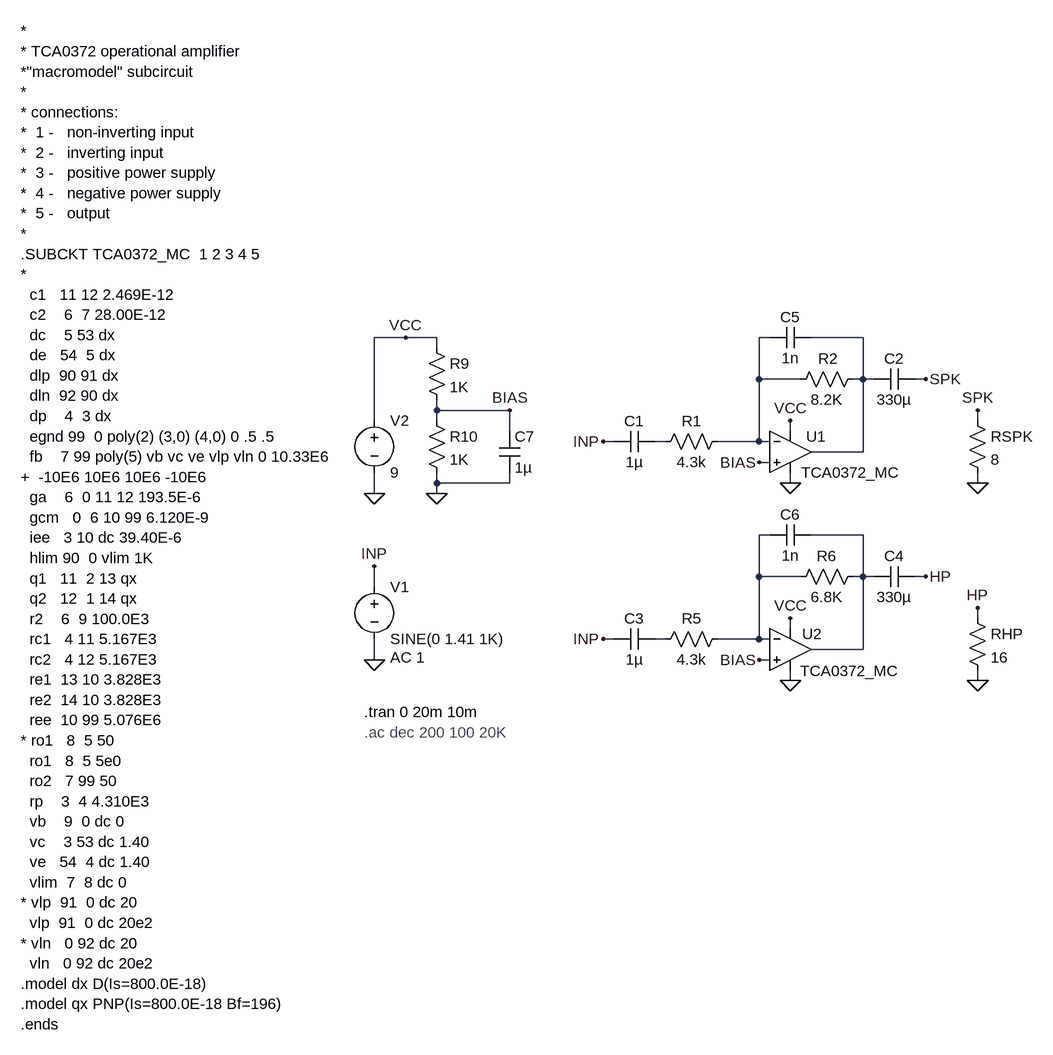
[diagram p0: schematic audio-amp.asc]
audio-amp.asc, the LTspice schematic file:
Version 4
SHEET 1 1860 1428
WIRE -784 -144 -832 -144
WIRE -736 -144 -784 -144
WIRE -224 -144 -240 -144
WIRE -80 -144 -160 -144
WIRE -736 -128 -736 -144
WIRE -240 -80 -240 -144
WIRE -176 -80 -240 -80
WIRE -80 -80 -80 -144
WIRE -80 -80 -96 -80
WIRE -64 -80 -80 -80
WIRE 16 -80 0 -80
WIRE -736 -32 -736 -48
WIRE -624 -32 -736 -32
WIRE -832 -16 -832 -144
WIRE -736 -16 -736 -32
WIRE 96 -16 96 -32
WIRE -624 0 -624 -32
WIRE -192 0 -192 -16
WIRE -464 16 -480 16
WIRE -384 16 -400 16
WIRE -240 16 -240 -80
WIRE -240 16 -304 16
WIRE -224 16 -240 16
WIRE -80 32 -80 -80
WIRE -80 32 -160 32
WIRE -224 48 -240 48
WIRE -736 80 -736 64
WIRE -624 80 -624 64
WIRE -624 80 -736 80
WIRE -192 80 -192 64
WIRE 96 80 96 64
WIRE -832 96 -832 64
WIRE -736 96 -736 80
WIRE -224 160 -240 160
WIRE -80 160 -160 160
WIRE -240 224 -240 160
WIRE -176 224 -240 224
WIRE -80 224 -80 160
WIRE -80 224 -96 224
WIRE -64 224 -80 224
WIRE 16 224 0 224
WIRE -832 240 -832 208
WIRE 96 288 96 272
WIRE -192 304 -192 288
WIRE -464 320 -480 320
WIRE -384 320 -400 320
WIRE -240 320 -240 224
WIRE -240 320 -304 320
WIRE -224 320 -240 320
WIRE -80 336 -80 224
WIRE -80 336 -160 336
WIRE -832 352 -832 320
WIRE -224 352 -240 352
WIRE -192 384 -192 368
WIRE 96 384 96 368
FLAG -832 352 0
FLAG -832 208 INP
FLAG -832 96 0
FLAG -784 -144 VCC
FLAG -480 16 INP
FLAG -192 -16 VCC
FLAG 96 80 0
FLAG -192 80 0
FLAG -480 320 INP
FLAG -192 288 VCC
FLAG 96 384 0
FLAG -192 384 0
FLAG 96 272 HP
FLAG -624 -32 BIAS
FLAG -736 96 0
FLAG -240 48 BIAS
FLAG -240 352 BIAS
FLAG 16 -80 SPK
FLAG 96 -32 SPK
FLAG 16 224 HP
SYMBOL voltage -832 224 R0
WINDOW 123 24 124 Left 2
WINDOW 39 0 0 Left 0
SYMATTR Value2 AC 1
SYMATTR InstName V1
SYMATTR Value SINE(0 1.41 1K)
SYMBOL voltage -832 -32 R0
WINDOW 123 0 0 Left 0
WINDOW 39 0 0 Left 0
SYMATTR InstName V2
SYMATTR Value 9
SYMBOL res -288 0 R90
WINDOW 0 0 56 VBottom 2
WINDOW 3 32 56 VTop 2
SYMATTR InstName R1
SYMATTR Value 4.3k
SYMBOL res -80 -96 R90
WINDOW 0 0 54 VBottom 2
WINDOW 3 32 56 VTop 2
SYMATTR InstName R2
SYMATTR Value 8.2K
SYMBOL cap -400 0 R90
WINDOW 0 0 32 VBottom 2
WINDOW 3 32 32 VTop 2
SYMATTR InstName C1
SYMATTR Value 1µ
SYMBOL res 80 -32 R0
SYMATTR InstName RSPK
SYMATTR Value 8
SYMBOL cap 0 -96 R90
WINDOW 0 0 32 VBottom 2
WINDOW 3 32 32 VTop 2
SYMATTR InstName C2
SYMATTR Value 330µ
SYMBOL Opamps\\opamp2 -192 -32 R0
WINDOW 3 17 96 Left 2
WINDOW 0 24 40 Left 2
SYMATTR Value TCA0372_MC
SYMATTR InstName U1
SYMBOL res -288 304 R90
WINDOW 0 0 56 VBottom 2
WINDOW 3 32 56 VTop 2
SYMATTR InstName R5
SYMATTR Value 4.3k
SYMBOL res -80 208 R90
WINDOW 0 0 56 VBottom 2
WINDOW 3 32 56 VTop 2
SYMATTR InstName R6
SYMATTR Value 6.8K
SYMBOL cap -400 304 R90
WINDOW 0 0 32 VBottom 2
WINDOW 3 32 32 VTop 2
SYMATTR InstName C3
SYMATTR Value 1µ
SYMBOL res 80 272 R0
SYMATTR InstName RHP
SYMATTR Value 16
SYMBOL cap 0 208 R90
WINDOW 0 0 32 VBottom 2
WINDOW 3 32 32 VTop 2
SYMATTR InstName C4
SYMATTR Value 330µ
SYMBOL Opamps\\opamp2 -192 272 R0
WINDOW 3 15 97 Left 2
WINDOW 0 18 40 Left 2
SYMATTR Value TCA0372_MC
SYMATTR InstName U2
SYMBOL cap -160 -160 R90
WINDOW 0 0 32 VBottom 2
WINDOW 3 32 32 VTop 2
SYMATTR InstName C5
SYMATTR Value 1n
SYMBOL cap -160 144 R90
WINDOW 0 0 32 VBottom 2
WINDOW 3 32 32 VTop 2
SYMATTR InstName C6
SYMATTR Value 1n
SYMBOL res -752 -144 R0
SYMATTR InstName R9
SYMATTR Value 1K
SYMBOL res -752 -32 R0
SYMATTR InstName R10
SYMATTR Value 1K
SYMBOL cap -640 0 R0
SYMATTR InstName C7
SYMATTR Value 1µ
TEXT -848 432 Left 2 !.tran 0 20m 10m
TEXT -848 464 Left 2 ;.ac dec 200 100 20K
TEXT -1376 -616 Left 2 !*\n* TCA0372 operational amplifier \n*"macromodel" subcircuit\n*\n* connections:\n*  1 -   non-inverting input\n*  2 -   inverting input\n*  3 -   positive power supply\n*  4 -   negative power supply\n*  5 -   output\n* \n.SUBCKT TCA0372_MC  1 2 3 4 5\n*\n  c1   11 12 2.469E-12\n  c2    6  7 28.00E-12\n  dc    5 53 dx\n  de   54  5 dx\n  dlp  90 91 dx\n  dln  92 90 dx\n  dp    4  3 dx\n  egnd 99  0 poly(2) (3,0) (4,0) 0 .5 .5\n  fb    7 99 poly(5) vb vc ve vlp vln 0 10.33E6\n+  -10E6 10E6 10E6 -10E6\n  ga    6  0 11 12 193.5E-6\n  gcm   0  6 10 99 6.120E-9\n  iee   3 10 dc 39.40E-6\n  hlim 90  0 vlim 1K\n  q1   11  2 13 qx\n  q2   12  1 14 qx\n  r2    6  9 100.0E3\n  rc1   4 11 5.167E3\n  rc2   4 12 5.167E3\n  re1  13 10 3.828E3\n  re2  14 10 3.828E3\n  ree  10 99 5.076E6\n* ro1   8  5 50\n  ro1   8  5 5e0\n  ro2   7 99 50\n  rp    3  4 4.310E3\n  vb    9  0 dc 0\n  vc    3 53 dc 1.40\n  ve   54  4 dc 1.40\n  vlim  7  8 dc 0\n* vlp  91  0 dc 20\n  vlp  91  0 dc 20e2\n* vln   0 92 dc 20\n  vln   0 92 dc 20e2\n.model dx D(Is=800.0E-18)\n.model qx PNP(Is=800.0E-18 Bf=196)\n.ends

The netlist it stands for:
* audio-amp.asc
V1 INP 0 SINE(0 1.41 1K) AC 1
V2 VCC 0 9
R1 N001 N003 4.3k
R2 N002 N001 8.2K
C1 N003 INP 1µ
RSPK SPK 0 8
C2 SPK N002 330µ
XU1 BIAS N001 VCC 0 N002 TCA0372_MC  ; pins In+ In- V+ V- OUT
R5 N004 N006 4.3k
R6 N005 N004 6.8K
C3 N006 INP 1µ
RHP HP 0 16
C4 HP N005 330µ
XU2 BIAS N004 VCC 0 N005 TCA0372_MC  ; pins In+ In- V+ V- OUT
C5 N002 N001 1n
C6 N005 N004 1n
R9 VCC BIAS 1K
R10 BIAS 0 1K
C7 BIAS 0 1µ
.tran 0 20m 10m
* .ac dec 200 100 20K
*
* TCA0372 operational amplifier
*"macromodel" subcircuit
*
* connections:
*  1 -   non-inverting input
*  2 -   inverting input
*  3 -   positive power supply
*  4 -   negative power supply
*  5 -   output
*
.SUBCKT TCA0372_MC  1 2 3 4 5
*
  c1   11 12 2.469E-12
  c2    6  7 28.00E-12
  dc    5 53 dx
  de   54  5 dx
  dlp  90 91 dx
  dln  92 90 dx
  dp    4  3 dx
  egnd 99  0 poly(2) (3,0) (4,0) 0 .5 .5
  fb    7 99 poly(5) vb vc ve vlp vln 0 10.33E6
+  -10E6 10E6 10E6 -10E6
  ga    6  0 11 12 193.5E-6
  gcm   0  6 10 99 6.120E-9
  iee   3 10 dc 39.40E-6
  hlim 90  0 vlim 1K
  q1   11  2 13 qx
  q2   12  1 14 qx
  r2    6  9 100.0E3
  rc1   4 11 5.167E3
  rc2   4 12 5.167E3
  re1  13 10 3.828E3
  re2  14 10 3.828E3
  ree  10 99 5.076E6
* ro1   8  5 50
  ro1   8  5 5e0
  ro2   7 99 50
  rp    3  4 4.310E3
  vb    9  0 dc 0
  vc    3 53 dc 1.40
  ve   54  4 dc 1.40
  vlim  7  8 dc 0
* vlp  91  0 dc 20
  vlp  91  0 dc 20e2
* vln   0 92 dc 20
  vln   0 92 dc 20e2
.model dx D(Is=800.0E-18)
.model qx PNP(Is=800.0E-18 Bf=196)
.ends
.backanno
.end